# EAGLE design NinjaPCR-140720 (EAGLE 6.6.0)
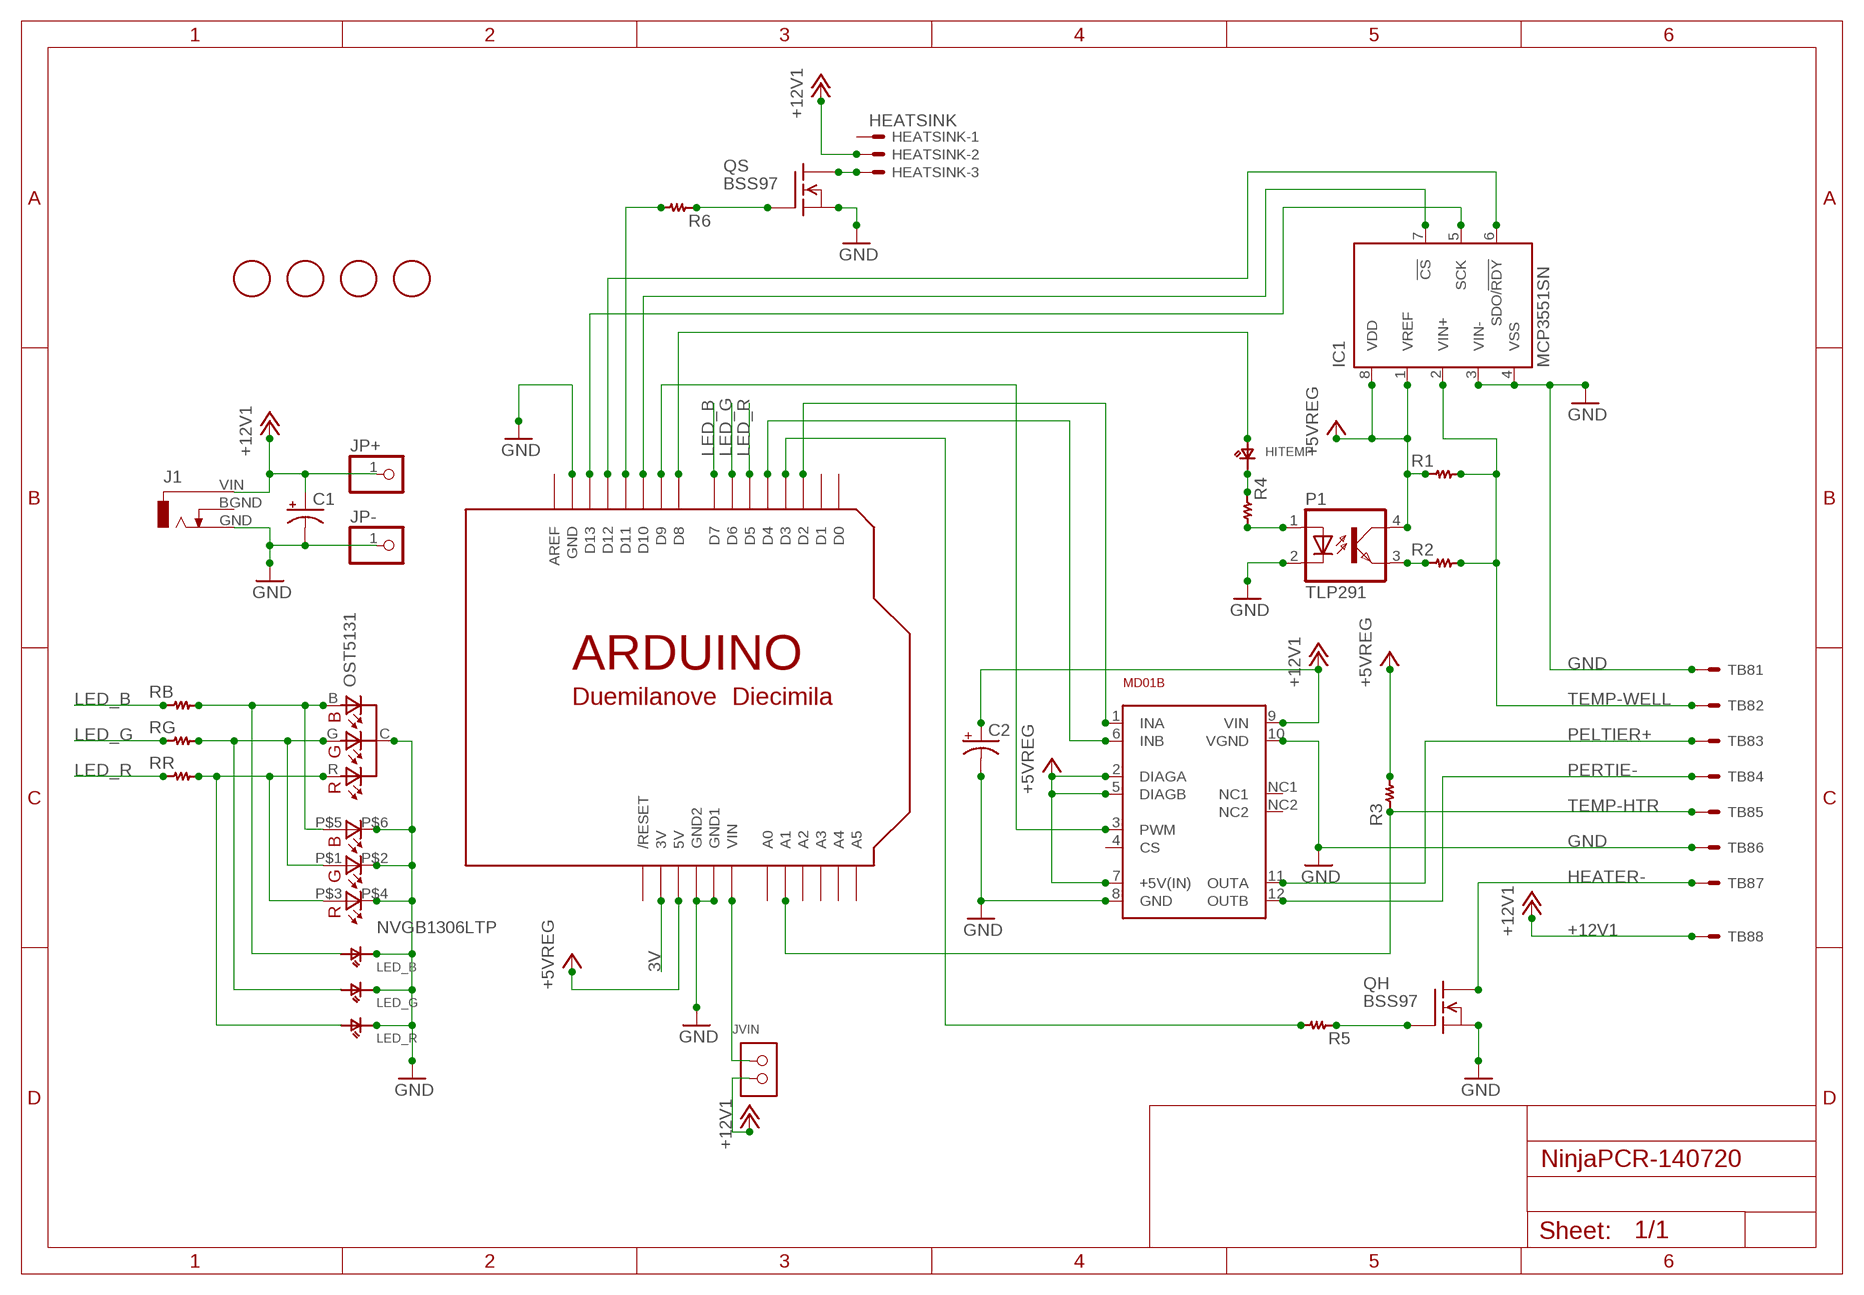
[diagram p0: schematic, sheet 1]

## Parts
C1  CPOL-USE5-8.5  [E5-8,5]
C2  CPOL-USE5-13  [E5-13]
HEATSINK  HEATSINK  22-23-2031  [22-23-2031]
HITEMP  LED1608  [SMD_1608_0603]
IC1  MCP3551SN  [SO-08]
J1  DCJ0303  [DCJ0303]
JP+  PINHD-1X1  [1X01]
JP-  PINHD-1X1  [1X01]
JVIN  1X02  [1X02_1.1_UNSIGNED]
LED_B  LED2012  [SMD_2012_0805]
LED_G  LED2012  [SMD_2012_0805]
LED_R  LED2012  [SMD_2012_0805]
MD01B  VNH3SP30+4PINN  [VNH3SP30+4PIN_NOHOLES]
P1  TLP291  TLP283  [MINI-FLAT-4]
QH  BSS97  [TO202]
QS  BSS97  [TO202]
R1  R_SMD1608  [SMD_1608_0603]
R2  R_SMD1608  [SMD_1608_0603]
R3  R_SMD1608  [SMD_1608_0603]
R4  R_SMD1608  [SMD_1608_0603]
R5  R_SMD1608  [SMD_1608_0603]
R6  R_SMD1608  [SMD_1608_0603]
RB  R_SMD1608  [SMD_1608_0603]
RG  R_SMD1608  [SMD_1608_0603]
RR  R_SMD1608  [SMD_1608_0603]
TB8  TB112A-2-8  [TB112A-2-8]
U$1  OST5131  [OSTA5131]
U$2  FIDUCIAL  [FIDUCIAL_1MM]
U$3  ARDUINODUEMILANOVE  [ARDUINO]
U$4  FIDUCIAL  [FIDUCIAL_1MM]
U$5  FIDUCIAL  [FIDUCIAL_1MM]
U$6  FIDUCIAL  [FIDUCIAL_1MM]
U$8  NVGB1306LTP  [NVGB1306L_TINYPADS]

## Nets
3V: U$3.3V
+5VREG [2A]: IC1.1(VREF) IC1.8(VDD) MD01B.2(DIAGA) MD01B.5(DIAGB) MD01B.7(+5V(IN)) P1.4(COL) R1.P$1 R3.P$2 U$3.5V
+12V1 [8A]: C1.+ C2.+ HEATSINK.2 J1.VIN JP+.1 JVIN.2 MD01B.9(VIN) TB8.P$8
B: LED_B.P$1(A) RB.P$2 U$1.B(BA) U$8.P$5(BA)
D13: IC1.5(SCK) U$3.D13
G: LED_G.P$1(A) RG.P$2 U$1.G(GA) U$8.P$1(GA)
GND [2A]: C1.- C2.- IC1.3(VIN-) IC1.4(VSS) J1.GND JP-.1 LED_B.P$2(C) LED_G.P$2(C) LED_R.P$2(C) MD01B.8(GND) MD01B.10(VGND) P1.2(C) QH.1(S) QS.1(S) TB8.P$1 TB8.P$6 U$1.C(CC) U$3.GND U$3.GND1 U$3.GND2 U$8.P$2(GC) U$8.P$4(RC) U$8.P$6(BC)
HEATER- [3A]: QH.2(D) TB8.P$7
LED_B: RB.P$1 U$3.D7
LED_G: RG.P$1 U$3.D6
LED_R: RR.P$1 U$3.D5
N$1: HEATSINK.3 QS.2(D)
N$2: QS.3(G) R6.P$1
N$3: R6.P$2 U$3.D11
N$4: P1.3(EMIT) R2.P$1
N$5: JVIN.1 U$3.VIN
N$6: HITEMP.P$1(A) U$3.D8
N$7: P1.1(A) R4.P$2
N$8: R5.P$2 U$3.D3
N$9: HITEMP.P$2(C) R4.P$1
N$27: IC1.6(SDO/!RDY) U$3.D12
N$29: IC1.7(!CS) U$3.D10
PELTIER+: MD01B.11(OUTA) TB8.P$3
PERTIE-: MD01B.12(OUTB) TB8.P$4
R: LED_R.P$1(A) RR.P$2 U$1.R(RA) U$8.P$3(RA)
S$1: MD01B.1(INA) U$3.D2
S$2: MD01B.3(PWM) U$3.D9
S$3: MD01B.6(INB) U$3.D4
T1: QH.3(G) R5.P$1
TEMP-HTR: R3.P$1 TB8.P$5 U$3.A1
TEMP-WELL: IC1.2(VIN+) R1.P$2 R2.P$2 TB8.P$2
Unconnected: HEATSINK.1 J1.BGND MD01B.4(CS) U$3.A0 U$3.A2 U$3.A3 U$3.A4 U$3.A5 U$3.AREF U$3.D0 U$3.D1 U$3.RESET(/RESET)

## Power pins joined to a net without a drawn wire
NC1: MD01B.NC1
NC2: MD01B.NC2

## Library data of the parts
C1 C2 = rcl:CPOL-US: POLARIZED CAPACITOR, American symbol
HEATSINK = con-molex:22-23-2031: .100" (2.54mm) Center Header - 3 Pin; MF: MOLEX; MPN: 22-23-2031; OC_FARNELL: 1462950; OC_NEWARK: 30C0862
HITEMP LED_B LED_G LED_R = SMD:LED
IC1 = microchip:MCP355*: Low-Power, Single-Channel 22-Bit Delta-Sigma ADCs Source: http://ww1.microchip.com/downloads/en/DeviceDoc/21950c.pdf; MPN: MCP3551-E/SN; OC_FARNELL: 1084625; OC_NEWARK: 97K4494
J1 = JACK:DCJ0303: DC POWER JACK Source: DCJ0303.pdf; OC_FARNELL: unknown; OC_NEWARK: unknown
JP+ JP- = pinhead:PINHD-1X1: PIN HEADER
JVIN = PIN:1X02
MD01B = MOTORDRIVE:VNH3SP30+4PIN
P1 = optocoupler:TLP283: TOSHIBA PHOTOCOUPLER GaAs IRED & PHOTO-TRANSISTOR Source: http://www.semicon.toshiba.co.jp/td/en/Opto/Photocoupler/en_20050928_TLP283_datasheet.pdf; OC_FARNELL: unknown; OC_NEWARK: unknown
QH QS = openpcr:BSS97: N-Channel Enhancement MOSFET 200V; 1.5A; 1,6Ohm
R1-R6 RB RG RR = SMD:R_SMD
TB8 = CONNECTOR:TB112A-2-8
U$1 = LED:OST5131
U$2 U$4-U$6 = adafruit:FIDUCIAL: For use by pick and place machines to calibrate the vision/machine, 1mm By microbuilder.eu
U$3 = openpcr:ARDUINO: Arduino Diecimila/Duemilanove Make a shield with ease, this package has all the named pins as well as the two mounting drill holes and an outline of the USB and DC power connector. The outline is on the DIMENSION layer, so if your board house uses it they will cut the outline to match. http://www.ladyada.net/library/pcb/eaglelibrary.html
U$8 = LED:NVGB1306L

## Net classes
0 default: width 0.381 mm
1 2A: width 0.406 mm
2 8A: width 2.54 mm
3 3A: width 1.016 mm

## Board
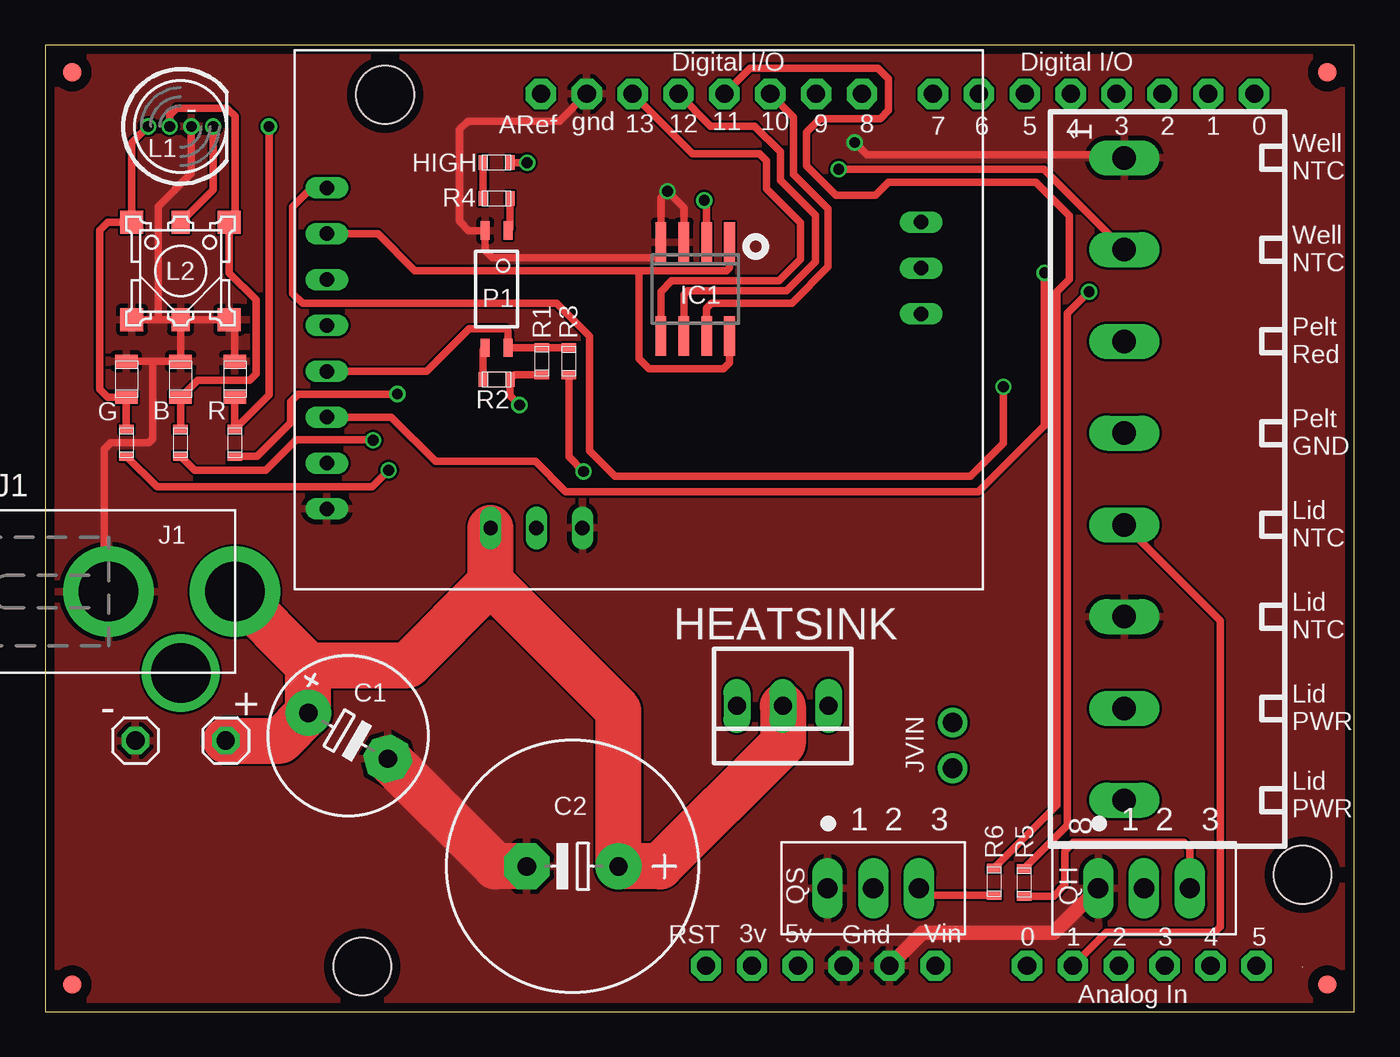
[diagram p1: board, top side]
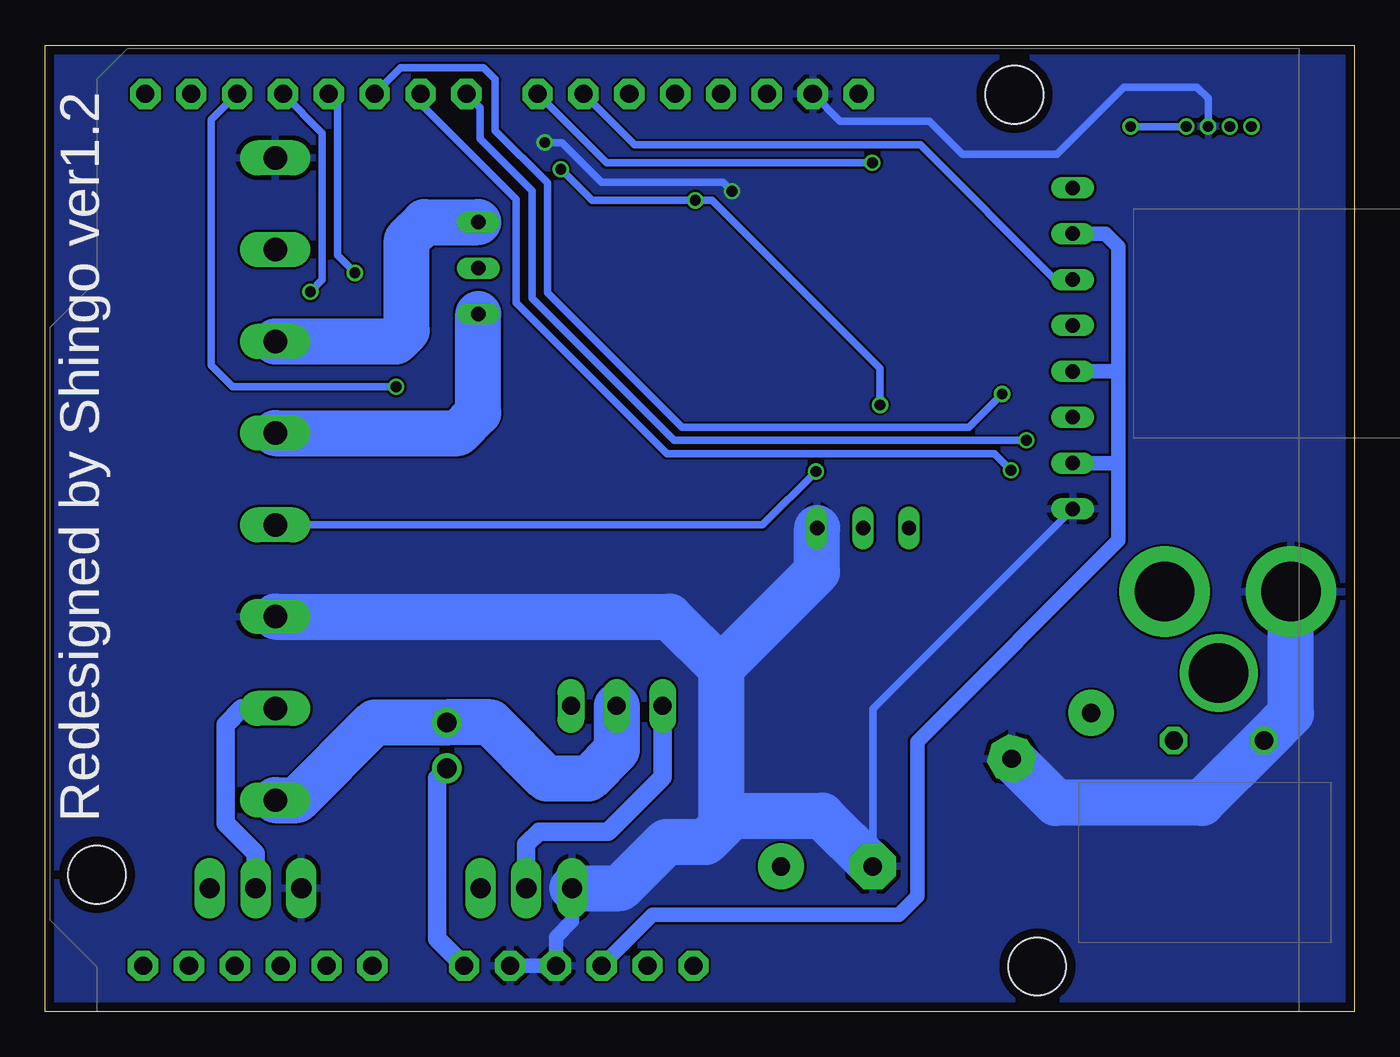
[diagram p2: board, bottom side, seen from below]

Size 72.5 x 53.5 mm. Coordinates in mm from the lower left corner, seen from the top.
Outline: 0,0 72.5,0 72.5,53.5 0,53.5 0,0
Copper layers (1*16): Top 0.035mm / dielectric 1.53mm / Bottom 0.035mm
Design rules "pban_5mil-l2": minimum track width 5mil, minimum drill 0.3mm, track to track 5mil, track to pad 0.229mm, pad to pad 5mil, via to via 5mil, smd to smd 5mil, copper to edge 0.5mm, drill to drill 0.5mm, minimum pad ring 0.15mm, minimum via ring 0.15mm, stop-mask expansion 4mil, vias tented up to drill 0.35mm, thermal gap 10mil
bKeepout: area 0,31 to 13,45

### Footprints (pad centres in the part's own frame; a part is rotated, then mirrored left to right if it is on the bottom)
E5-8,5 = drill 1.016 pad 2.54: + -2.54,0 | drill 1.016 pad 2.54 octagon: - 2.54,0
E5-13 = drill 1.016 pad 2.54: + -2.54,0 | drill 1.016 pad 2.54 octagon: - 2.54,0
22-23-2031 = drill 1 long: 1 -2.54,0; 2 0,0; 3 2.54,0
SMD_1608_0603 = smd 0.5 x 0.8: P$1 -0.75,0; P$2 0.75,0
SO-08 = smd 0.6 x 2.2: 1 -1.905,-2.6; 2 -0.635,-2.6; 3 0.635,-2.6; 4 1.905,-2.6; 5 1.905,2.6; 6 0.635,2.6; 7 -0.635,2.6; 8 -1.905,2.6
DCJ0303 = drill 3.3 pad 4: BGND 4.5,-3 | drill 3.3 pad 5: GND 0,-7; VIN 0,0
1X01 = drill 1.016 octagon: 1 0,0
1X02_1.1_UNSIGNED = drill 1.1: 1 -2.54,0; 2 0,0
SMD_2012_0805 = smd 0.7 x 1.25: P$1 -1,0; P$2 1,0
VNH3SP30+4PIN_NOHOLES = drill 0.8 long: 1 1.778,22.225; 2 1.778,19.685; 3 1.778,17.145; 4 1.778,14.605; 5 1.778,12.065; 6 1.778,9.525; 7 1.778,6.985; 8 1.778,4.445; 9 10.846,3.4; 10 15.926,3.4; 11 34.7,20.32; 12 34.7,15.24; NC1 13.386,3.4; NC2 34.7,17.78
MINI-FLAT-4 = smd 1 x 0.5: 1 -3.24,0.635; 2 -3.24,-0.635; 3 3.24,-0.635; 4 3.24,0.635
TO202 = drill 1.118 long: 1 -2.54,-5.08; 2 0,-5.08; 3 2.54,-5.08
TB112A-2-8 = drill 1.3 long: P$1 -17.78,0; P$2 -12.7,0; P$3 -7.62,0; P$4 -2.54,0; P$5 2.54,0; P$6 7.62,0; P$7 12.7,0; P$8 17.78,0
OSTA5131 = drill 0.6 pad 0.813: B -0.6,0; C 0.6,0; G -1.8,0; R 1.8,0
FIDUCIAL_1MM = smd 1 x 1: 1 0,0
ARDUINO = drill 1 pad 1.676 octagon: 3V 36.068,2.54; 5V 38.608,2.54; A0 51.308,2.54; A1 53.848,2.54; A2 56.388,2.54; A3 58.928,2.54; A4 61.468,2.54; A5 64.008,2.54; AREF 24.384,50.8; D0 63.881,50.8; D1 61.341,50.8; D2 58.801,50.8; D3 56.261,50.8; D4 53.721,50.8; D5 51.181,50.8; D6 48.641,50.8; D7 46.101,50.8; D8 42.164,50.8; D9 39.624,50.8; D10 37.084,50.8; D11 34.544,50.8; D12 32.004,50.8; D13 29.464,50.8; GND 26.924,50.8; GND1 43.688,2.54; GND2 41.148,2.54; RESET 33.528,2.54; VIN 46.228,2.54 | hole 3.2: 15.758,50.754; 66.558,7.574; 14.488,2.494
NVGB1306L_TINYPADS = smd 1.27 x 1.27: P$1 -2.7,2.7; P$2 -2.7,-2.7; P$5 2.7,2.7; P$6 2.7,-2.7 | smd 1 x 1.27: P$3 0,2.7; P$4 0,-2.7

### Placement (x,y rotation side)
C1  16.77,15.27 330 top
C2  29.21,8.04 180 top
HEATSINK  40.85,16.92 180 top
HITEMP  25,47 180 top
IC1  36,40 180 top
J1  10.51,23.25 270 top
JP+  10,15 0 top
JP-  5,15 0 top
JVIN  50.26,16.01 90 top
LED_B  7.5,35 90 top
LED_G  4.5,35 90 top
LED_R  10.5,35 90 top
MD01B  13.82,23.38 0 top
P1  25,40 270 top
QH  60.85,11.91 0 top
QS  45.85,11.91 0 top
R1  27.5,36 270 top
R2  25,35 0 top
R3  29,36 90 top
R4  25,45 0 top
R5  54.2,7.15 90 top
R6  52.55,7.2 90 top
RB  7.5,31.5 90 top
RG  4.5,31.5 90 top
RR  10.5,31.5 90 top
TB8  59.76,29.48 270 top
U$1  7.5,49 0 top
U$2  1.5,1.5 0 top
U$3  3.07,0 0 top
U$4  71,1.5 0 top
U$5  1.5,52 0 top
U$6  71,52 0 top
U$8  7.5,41 0 top

### Tracks (layer width: path | path; a pad name or v marks a point on that pad's centre or on a via)
+5VREG
  Top 0.406: R3.P$2 R1.P$1 P1.4 25.64,37.66 25.5,37.8 23.47,37.8 21.12,35.45 MD01B.5 | IC1.1 37.91,41.18 37.74,41.02 32.92,41.02 | 32.92,41.02 20.47,41.02 18.43,43.06 MD01B.2 | IC1.8 37.91,35.92 37.57,35.59 33.45,35.59 32.89,36.14 32.89,41 32.92,41.02
  Bottom 0.813: U$3.5V 38.86,5.36 25.22,5.36 24.21,6.38 24.21,14.94 13.06,26.09 13.06,30.36 | 13.06,30.36 13.06,35.45 | 13.06,35.45 13.06,42.34 13.78,43.06 MD01B.2 | MD01B.7 13.06,30.36 | MD01B.5 13.06,35.45
+12V1
  Top 2.54: JP+.1 13.04,15 C1.+ 14.57,19.18 | 24.67,23.76 MD01B.9 | 14.57,19.18 J1.VIN | 14.57,19.18 20.09,19.18 24.67,23.76 | HEATSINK.2 40.85,14.84 34.05,8.04 C2.+ 31.75,16.67 24.67,23.76
  Bottom 2.54: HEATSINK.2 40.85,14.47 42.42,12.9 44.73,12.9 47.83,16.01 JVIN.2 54.25,16.01 58.56,11.7 TB8.P$8
B
  Top 0.406: RB.P$2 LED_B.P$1 8.45,34.95 11.33,34.95 11.68,35.31 11.68,39.4 10.2,40.88 U$8.P$5 10.52,44.02 10.52,49.55 10.06,50.01 7.29,50.01 6.9,49.62 U$1.B
D13
  Top 0.406: U$3.D13 35.84,47.5 39.55,47.5 39.95,47.09 39.95,45.54 41.83,43.66 41.83,41.66 40.64,40.46 34.7,40.46 34.09,39.86 IC1.5
G
  Top 0.406: RG.P$2 LED_G.P$1 3.46,34 3.02,34.44 3.02,43.26 3.47,43.7 U$8.P$1 4.8,48.1 U$1.G
GND  (via drill 0.6)
  Top 0.406: LED_R.P$2 10.5,38.3 U$8.P$6 U$8.P$4 | 4.5,38.3 U$8.P$2 6.25,38.3 | U$8.P$4 LED_B.P$2 5.92,36 | 6.25,38.3 6.25,44.55 8.1,46.4 U$1.C | U$8.P$4 6.25,38.3 | U$3.GND 28.5,49.3 23.42,49.3 22.96,48.84 22.96,43.74 23.46,43.24 P1.2 24.36,42.16 24.79,41.73 34.09,41.73 IC1.4 34.09,45.04 v34.47,45.41 34.58,45.31 34.58,45.3 35.37,44.51 IC1.3 | v44.83,48.11 45.52,47.42 59.6,47.42 TB8.P$1 | J1.GND 3.28,23.48 3.28,31.14 3.63,31.5 5.74,31.5 5.94,31.7 5.94,35.98 5.92,36 | 5.92,36 LED_G.P$2
  Top 0.813: U$3.GND1 48.59,4.37 55.85,4.37 QH.1
  Top 2.54: C2.- 24.93,8.04 C1.-
  Bottom 0.406: MD01B.8 26.67,16.75 C2.- | U$1.C 8.1,50.57 8.71,51.18 12.78,51.18 16.48,47.47 21.69,47.47 23.52,49.3 28.5,49.3 U$3.GND | v34.47,45.41 34.98,45.92 41.68,45.92 43.87,48.11 v44.83,48.11
  Bottom 0.813: U$3.GND1 U$3.GND2 44.22,4.12 43.31,5.02 QS.1
  Bottom 2.54: QS.1 40.66,6.83 38.1,9.4 35.92,9.4 35.08,10.24 | 35.08,10.24 34.47,10.85 29.48,10.85 C2.- | TB8.P$6 37.91,21.86 35.08,19.02 | 35.08,19.02 35.08,10.24 | C1.- 16.53,11.56 8.44,11.56 JP-.1 3.51,16.49 J1.GND | 35.08,19.02 29.75,24.36 MD01B.10
  pour Bottom: -1,54.5 73.5,54.5 73.5,-1 -1,-1
  pour Top: -2,55.5 74.5,55.5 74.5,-2 -2,-2
HEATER-
  Bottom 1.016: QH.2 60.85,8.76 62.51,10.41 62.51,15.88 61.6,16.78 TB8.P$7
LED_B  (via drill 0.6)
  Top 0.406: RB.P$1 8.28,29.97 12.22,29.97 13.89,31.65 18.14,31.65 v18.16,31.62
  Bottom 0.406: v18.16,31.62 37.67,31.62 45.54,39.5 45.54,45.44 48.41,48.31 48.41,50.04 U$3.D7
LED_G  (via drill 0.6)
  Top 0.406: RG.P$1 6.19,29.06 18.11,29.06 v19.02,29.97
  Bottom 0.406: v19.02,29.97 19.94,30.89 38.08,30.89 46.43,39.24 46.43,44.98 51.71,50.26 U$3.D6
LED_R  (via drill 0.6)
  Top 0.406: RR.P$1 11.75,30.75 13.59,32.59 13.59,33.76 14.02,34.19 v19.51,34.19
  Bottom 0.406: v19.51,34.19 21.34,32.36 37.24,32.36 44.68,39.8 44.68,45.87 47.57,48.77 47.57,51.61 48.21,52.25 52.8,52.25 U$3.D5
N$1
  Bottom 1.016: HEATSINK.3 38.31,12.98 41.33,9.96 45.16,9.96 45.85,9.26 QS.2
N$2
  Top 0.406: R6.P$1 48.78,6.45 QS.3
N$3
  Top 0.406: R6.P$2 56.03,11.43 56.03,39.85 56.72,40.54 56.72,44.04 54.86,45.9 46.69,45.9 45.97,45.19 43.79,45.19 42.16,46.81 42.16,48.69 42.9,49.43 46.25,49.43 46.71,49.89 46.71,51.64 46.13,52.22 39.04,52.22 U$3.D11
N$4
  Top 0.406: P1.3 24.25,36.65 R2.P$1
N$5
  Bottom 1.016: JVIN.1 50.8,12.93 50.8,4.04 U$3.VIN
N$6  (via drill 0.6)
  Top 0.406: v26.7,46.99 26.68,47 HITEMP.P$1
  Bottom 0.406: U$3.D8 41.42,46.99 v26.7,46.99
N$7
  Top 0.406: P1.1 25.75,43.35 R4.P$2
N$8  (via drill 0.6)
  Top 0.406: R5.P$2 56.62,10.31 56.62,38.66 v57.81,39.85
  Bottom 0.406: v57.81,39.85 57.15,40.51 57.15,48.62 U$3.D3
N$9
  Top 0.406: HITEMP.P$2 R4.P$1
N$27
  Top 0.406: U$3.D12 36.85,49.02 39.29,49.02 40.72,47.6 40.72,46.02 42.65,44.09 42.65,41.5 41.05,39.9 35.59,39.9 35.37,39.68 IC1.6
N$29
  Top 0.406: U$3.D10 41.45,49.5 41.45,46.35 43.36,44.45 43.36,41.22 41.35,39.22 36.91,39.22 36.63,38.95 IC1.7
PELTIER+
  Bottom 2.54: TB8.P$3 53.07,37.1 52.48,37.69 52.48,42.72 51.5,43.7 MD01B.11
PERTIE-
  Bottom 2.54: TB8.P$4 49.64,32.02 48.52,33.14 MD01B.12
R  (via drill 0.6)
  Top 0.406: LED_R.P$1 RR.P$2 12.39,34.15 v12.39,49 | U$8.P$3 9.3,45.5 U$1.R
  Bottom 0.406: v12.39,49 U$1.R
S$1  (via drill 0.6)
  Top 0.406: MD01B.1 14.77,45.6 13.72,44.55 13.72,39.75 14.25,39.22 28.32,39.22 30.15,37.39 30.15,31.04 31.55,29.64 51.23,29.64 53.06,31.47 v53.06,34.59
  Bottom 0.406: v53.06,34.59 62.1,34.59 63.3,35.79 63.3,49.37 U$3.D2
S$2
  Bottom 0.406: U$3.D9 39.88,47.98 24.03,47.98 16.57,40.52 MD01B.3
S$3  (via drill 0.6)
  Top 0.406: MD01B.6 19.16,32.91 21.61,30.45 27.15,30.45 28.83,28.78 51.69,28.78 55.35,32.44 v55.35,40.89
  Bottom 0.406: v55.35,40.89 56.31,41.86 56.31,50.32 U$3.D4
T1
  Top 0.406: R5.P$1 55.85,6.4 56.46,7.01 56.46,8.89 56.95,9.37 63.07,9.37 63.4,9.05 QH.3
TEMP-HTR  (via drill 0.6)
  Top 0.406: U$3.A1 58.77,4.39 64.77,4.39 65.08,4.7 65.08,21.63 TB8.P$5 | v29.82,29.9 29,30.71 R3.P$1
  Bottom 0.406: TB8.P$5 32.77,26.94 v29.82,29.9
TEMP-WELL  (via drill 0.6)
  Top 0.406: R1.P$2 26,35.25 R2.P$2 25.75,34.09 v26.26,33.58 | v43.94,46.63 55.31,46.63 TB8.P$2 | IC1.2 36.63,44.77 v36.5,44.91
  Bottom 0.406: v43.94,46.63 42.22,44.91 v36.5,44.91 35.56,44.91 26.26,35.61 v26.26,33.58

### Text on the board
tPlace: Well / NTC | Well / NTC | Pelt / Red | Pelt / GND | Lid / NTC | Lid / NTC | Lid / PWR | Lid / PWR
bPlace: Redesigned by Shingo ver1.2
tNames: L1 | HIGH | R4 | L2 | P1 | IC1 | R1 | R3 | G | B | R | R2 | J1 | HEATSINK | C1 | - | + | JVIN | C2 | R6 | R5 | QS | QH